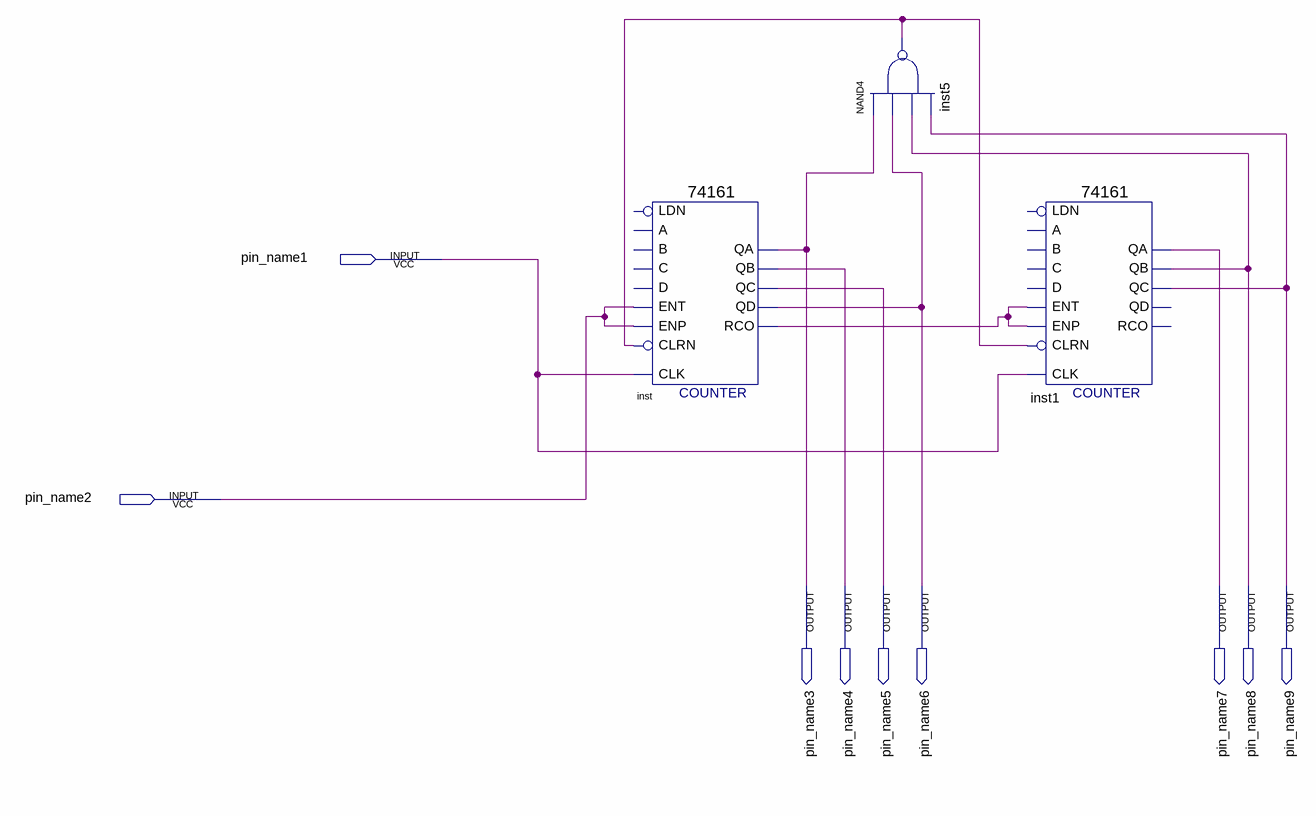
[diagram p0: schematic sheet]
// Quartus schematic licznik74161.bdf as structural Verilog: 3 symbols, 9 pins
module licznik74161 (
  input  pin_name1,
  input  pin_name2,
  output pin_name3,
  output pin_name4,
  output pin_name5,
  output pin_name6,
  output pin_name7,
  output pin_name8,
  output pin_name9
);

  wire inst5_out, inst_rco;

  \74161  inst (
    .CLRN(inst5_out), .CLK(pin_name1), .ENP(pin_name2), .ENT(pin_name2), .QD(pin_name6), .QC(pin_name5),
    .QB(pin_name4), .QA(pin_name3), .RCO(inst_rco));  // open: LDN, A, D, B, C
  nand inst5 (inst5_out, pin_name3, pin_name6, pin_name8, pin_name9);
  \74161  inst1 (
    .CLRN(inst5_out), .CLK(pin_name1), .ENP(inst_rco), .ENT(inst_rco), .QC(pin_name9), .QB(pin_name8),
    .QA(pin_name7));  // open: LDN, A, D, B, C, QD, RCO
endmodule
